# Altium project Capstone_Vent.PrjPcb
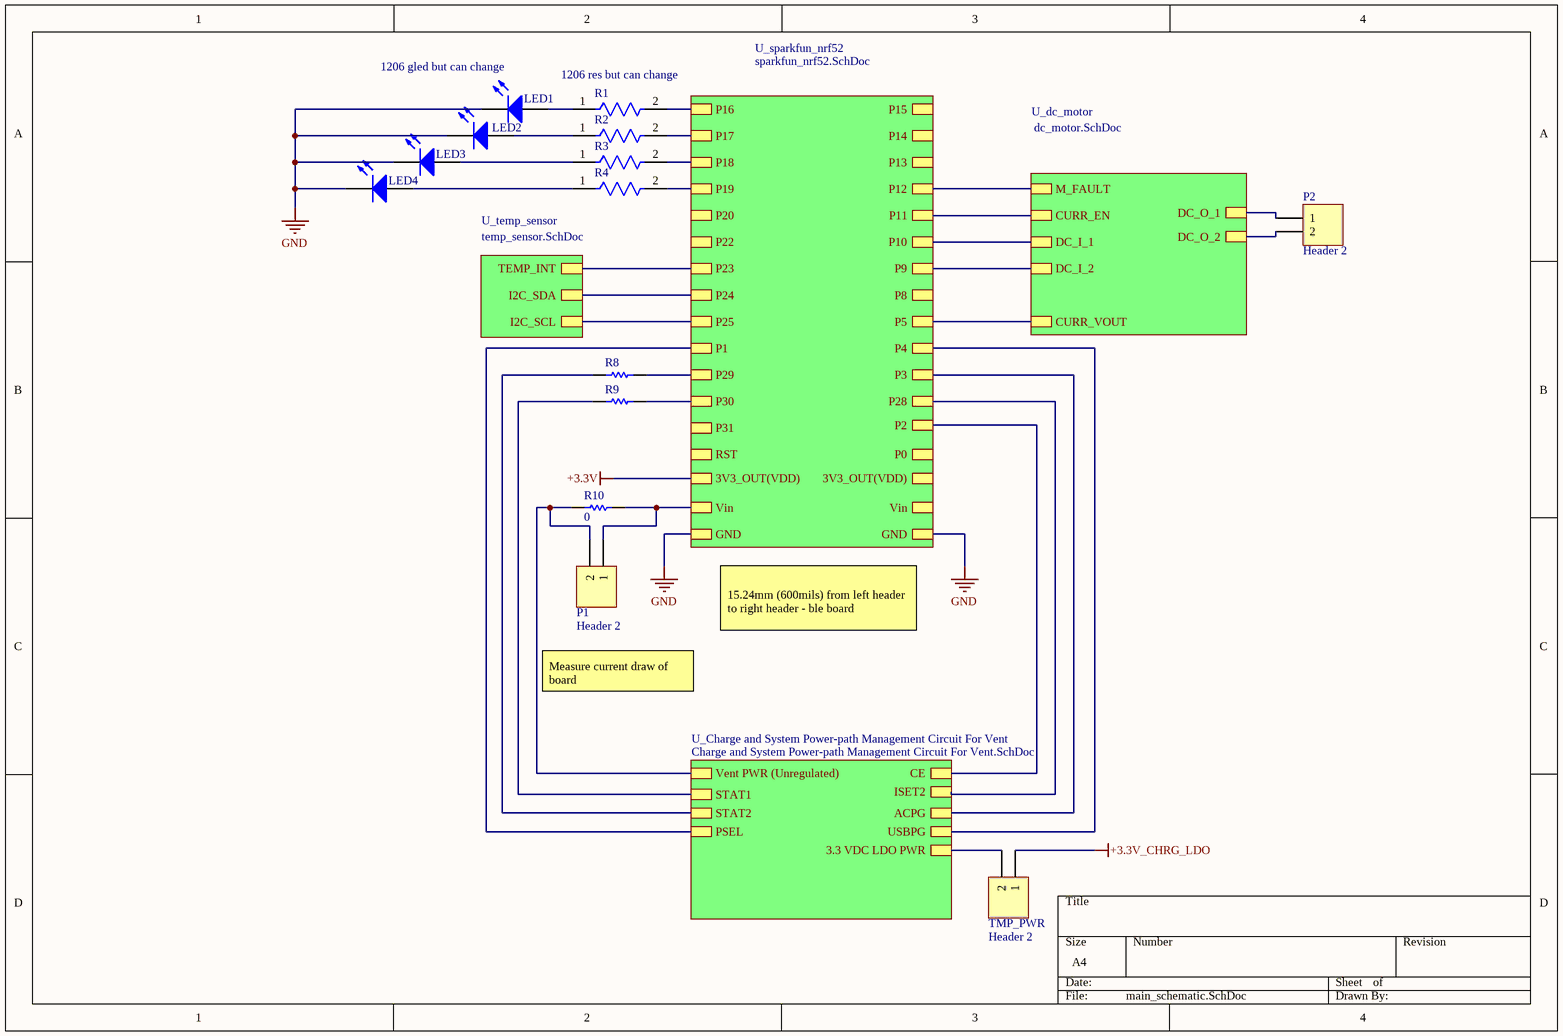
[diagram p0: main_schematic.SchDoc]
5 sheets, 56 parts. Net scope: hierarchical (ports join the sheet entries above them; power ports are global).
Board file: Vent_pcb.PcbDoc
Sheets:
  main_schematic.SchDoc
    U_sparkfun_nrf52 = sparkfun_nrf52.SchDoc
    U_temp_sensor = temp_sensor.SchDoc
    U_dc_motor = dc_motor.SchDoc
    U_Charge and System Power-path Management Circuit For Vent = Charge and System Power-path Management Circuit For Vent.SchDoc

## Sheet main_schematic.SchDoc
size A4

### Parts
LED1  (no value)  [1206_A]
LED2  (no value)  [1206_A]
LED3  (no value)  [1206_A]
LED4  (no value)  [1206_A]
P1  Header 2  [HDR1X2]
P2  Header 2  [HDR1X2]
R1  (no value)  [FP-RC1206-MFG]
R2  (no value)  [FP-RC1206-MFG]
R3  (no value)  [FP-RC1206-MFG]
R4  (no value)  [FP-RC1206-MFG]
R8  RC0805FR-0710KL  [RESC2013X60X35NL10T20]  (value not drawn)
R9  RC0805FR-0710KL  [RESC2013X60X35NL10T20]  (value not drawn)
R10  0  [RESC2013X70X40LL20T20]
TMP_PWR  Header 2  [HDR1X2]

### Sub-sheets
U_Charge and System Power-path Management Circuit For Vent = Charge and System Power-path Management Circuit For Vent.SchDoc: ISET2, STAT1, STAT2, USBPG, CE, PSEL, ACPG, Vent PWR (Unregulated), 3.3 VDC LDO PWR
U_dc_motor = dc_motor.SchDoc: DC_I_1, DC_I_2, M_FAULT, CURR_VOUT, CURR_EN, DC_O_2, DC_O_1
U_sparkfun_nrf52 = sparkfun_nrf52.SchDoc: P16, P17, P18, P19, P20, P22, P23, P24, P25, P28, P29, P30, P31, RST, Vin, GND, P15, P14, P13, P12, P11, P10, P9, P8, P5, P4, P3, P2, P1, P0, GND, 3V3_OUT(VDD), 3V3_OUT(VDD), Vin
U_temp_sensor = temp_sensor.SchDoc: I2C_SCL, TEMP_INT, I2C_SDA

### Nets
+3.3V: sheet U_sparkfun_nrf52/3V3_OUT(VDD), sheet U_sparkfun_nrf52/3V3_OUT(VDD)
+3.3V_CHRG_LDO: TMP_PWR.1
GND: LED1.1(K) LED2.1(K) LED3.1(K) LED4.1(K) ; sheet U_sparkfun_nrf52/GND, sheet U_sparkfun_nrf52/GND
NetC3_2: TMP_PWR.2 ; sheet U_Charge and System Power-path Management Circuit For Vent/3.3 VDC LDO PWR
NetC4_2: P1.2 R10.2 ; sheet U_Charge and System Power-path Management Circuit For Vent/Vent PWR (Unregulated)
NetIC1_1: P2.2 ; sheet U_dc_motor/DC_O_2
NetIC1_3: P2.1 ; sheet U_dc_motor/DC_O_1
NetIC1_6: sheet U_sparkfun_nrf52/P12, sheet U_dc_motor/M_FAULT
NetIC1_9: sheet U_sparkfun_nrf52/P10, sheet U_dc_motor/DC_I_1
NetIC1_10: sheet U_sparkfun_nrf52/P9, sheet U_dc_motor/DC_I_2
NetIC2_2: sheet U_sparkfun_nrf52/P11, sheet U_dc_motor/CURR_EN
NetIC2_5: sheet U_sparkfun_nrf52/P5, sheet U_dc_motor/CURR_VOUT
NetLED1_2: LED1.2(A) R1.1
NetLED2_2: LED2.2(A) R2.1
NetLED3_2: LED3.2(A) R3.1
NetLED4_2: LED4.2(A) R4.1
NetP1_1: P1.1 R10.1 ; sheet U_sparkfun_nrf52/Vin, sheet U_sparkfun_nrf52/Vin
NetPL_6: R9.2 ; sheet U_sparkfun_nrf52/P30
NetPL_7: R8.2 ; sheet U_sparkfun_nrf52/P29
NetPL_8: sheet U_sparkfun_nrf52/P28, sheet U_Charge and System Power-path Management Circuit For Vent/ISET2
NetPL_9: sheet U_sparkfun_nrf52/P25, sheet U_temp_sensor/I2C_SCL
NetPL_10: sheet U_sparkfun_nrf52/P24, sheet U_temp_sensor/I2C_SDA
NetPL_11: sheet U_sparkfun_nrf52/P23, sheet U_temp_sensor/TEMP_INT
NetPL_14: R4.2 ; sheet U_sparkfun_nrf52/P19
NetPL_15: R3.2 ; sheet U_sparkfun_nrf52/P18
NetPL_16: R2.2 ; sheet U_sparkfun_nrf52/P17
NetPL_17: R1.2 ; sheet U_sparkfun_nrf52/P16
NetPR_5: sheet U_sparkfun_nrf52/P1, sheet U_Charge and System Power-path Management Circuit For Vent/PSEL
NetPR_6: sheet U_sparkfun_nrf52/P2, sheet U_Charge and System Power-path Management Circuit For Vent/CE
NetPR_7: sheet U_sparkfun_nrf52/P3, sheet U_Charge and System Power-path Management Circuit For Vent/ACPG
NetPR_8: sheet U_sparkfun_nrf52/P4, sheet U_Charge and System Power-path Management Circuit For Vent/USBPG
NetR8_1: R8.1 ; sheet U_Charge and System Power-path Management Circuit For Vent/STAT2
NetR9_1: R9.1 ; sheet U_Charge and System Power-path Management Circuit For Vent/STAT1

### Notes on the sheet
- (near LED1) 1206 gled but can change
- (near R1) 1206 res but can change
- 15.24mm (600mils) from left header to right header - ble board
- Measure current draw of board

### Library data of the parts
LED1-LED4 = CMP-1426-00016-1: QTLP650C4TR / 1206 green led; PartNumber: 150120VS75000; Manufacturer: Wuerth Elektronik; Color: Bright Green; ComponentLink2URL: http://katalog.we-online.com/led/datasheet/150120VS75000.pdf; ComponentLink2Description: Datasheet; ComponentLink1URL: http://www.we-online.com; PackageReference: 1206_A; ComponentLink1Description: Manufacturer URL
P1 P2 TMP_PWR = Header 2: Header, 2-Pin; LatestRevisionDate: 17-Jul-2002; LatestRevisionNote: Re-released for DXP Platform.; Publisher: Altium Limited
R1-R4 = CMP-03412-007570-1: 360 ohms resistor / 1206 package; Manufacturer Part Number: RC1206JR-070RL; Manufacturer: YAGEO; Voltage Rating: 200V; Temperature Coefficient: 300ppm/°C; Power Rating: 0.25W; Value: 0Ω; Tolerance: 5%; Temperature Range Low: -55°C; Category: Res; Automotive: No; Ipc Land Pattern Name: RESC310160X55; Device Class L1: Passive Components; Temperature: -55°C to +155°C; ComponentLink2URL: https://www.yageo.com/upload/media/product/productsearch/datasheet/rchip/PYu-RC_Group_51_RoHS_L_10.pdf; Lead Free: Yes; Height: 0.65mm; Footprint Url: https://www.yageo.com/upload/website/yageo_PYu-R_Mount_10_19050818_343.pdf; Package: RC1206; Digikey Description: RES SMD 0 OHM JUMPER 1/4W 1206; Temperature Range High: +155°C; Device Class L3: Chip SMD Resistors; Device Class L2: Resistors; Octopart: https://octopart.com/rc1206jr-070rl-yageo-40025601; Resistance: 0Ω; Series: RC; ComponentLink2Description: Datasheet; Composition: Thick Film; RoHS: TRUE; Mouser Description: Resistor: thick film; SMD; 1206; 0O; 0.25W; ±5%; -55÷155°C
R8 R9 = CMP-1659-00013-4: Chip Resistor, 10 KOhm, +/- 1%, 0.125 W, -55 to 155 degC, 0805 (2012 Metric), RoHS, Tape and Reel; Manufacturer: Yageo; Voltage Rating: 150 V; Mount: Surface Mount; ComponentLink1Description: Manufacturer URL; ComponentLink2URL: http://www.yageo.com/documents/recent/PYu-RC_Group_51_RoHS_L_04.pdf; Pins: 2; Length: 2 mm; Min Operating Temperature: -55 degC; Height: 0.5 mm; Mounting Technology: Surface Mount; RoHSCompliant: true; REACH SVHC: No SVHC; ComponentLink1URL: http://www.yageo.com/; Max Operating Temperature: 155 degC; PackageReference: 0805; DatasheetVersion: Rev. 4, 02/2016; Package Quantity: 5000; Packaging: Tape and Reel; ComponentLink2Description: Datasheet; PackageDescription: 2-Pin Surface Mounted Device, Body 2 x 1.25 mm
R10 = CMP-2001-00419-1: 2012; Part Number: ERJ-6GEYJ471V; Manufacturer: Panasonic

## Sheet sparkfun_nrf52.SchDoc
size A4
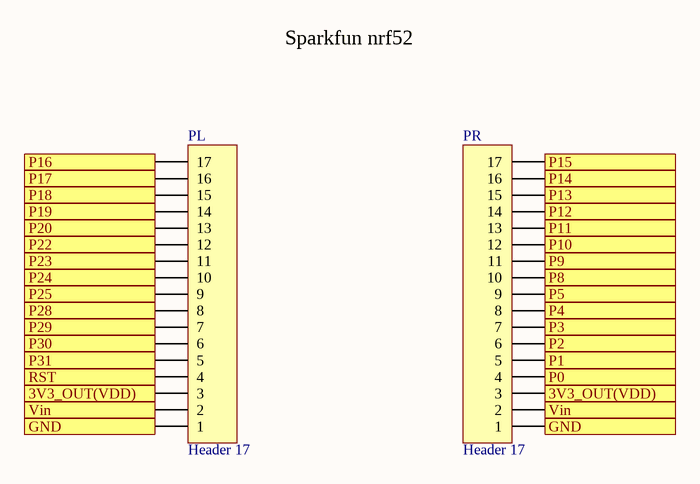
[diagram p1: sparkfun_nrf52.SchDoc]

### Parts
PL  Header 17  [HDR1X17]
PR  Header 17  [HDR1X17]

### Ports
3V3_OUT(VDD), GND, P0, P1, P2, P3, P4, P5, P8, P9, P10, P11, P12, P13, P14, P15, P16, P17, P18, P19, P20, P22, P23, P24, P25, P28, P29, P30, P31, RST, Vin

### Nets
+3.3V: PL.3 PR.3 ; port 3V3_OUT(VDD)
GND: PL.1 PR.1 ; port GND
NetIC1_6: PR.14 ; port P12
NetIC1_9: PR.12 ; port P10
NetIC1_10: PR.11 ; port P9
NetIC2_2: PR.13 ; port P11
NetIC2_5: PR.9 ; port P5
NetP1_1: PL.2 PR.2 ; port Vin
NetPL_4: PL.4 ; port RST
NetPL_5: PL.5 ; port P31
NetPL_6: PL.6 ; port P30
NetPL_7: PL.7 ; port P29
NetPL_8: PL.8 ; port P28
NetPL_9: PL.9 ; port P25
NetPL_10: PL.10 ; port P24
NetPL_11: PL.11 ; port P23
NetPL_12: PL.12 ; port P22
NetPL_13: PL.13 ; port P20
NetPL_14: PL.14 ; port P19
NetPL_15: PL.15 ; port P18
NetPL_16: PL.16 ; port P17
NetPL_17: PL.17 ; port P16
NetPR_4: PR.4 ; port P0
NetPR_5: PR.5 ; port P1
NetPR_6: PR.6 ; port P2
NetPR_7: PR.7 ; port P3
NetPR_8: PR.8 ; port P4
NetPR_10: PR.10 ; port P8
NetPR_15: PR.15 ; port P13
NetPR_16: PR.16 ; port P14
NetPR_17: PR.17 ; port P15

### Notes on the sheet
- Sparkfun nrf52

### Library data of the parts
PL PR = Header 17: Header, 17-Pin; LatestRevisionDate: 17-Jul-2002; LatestRevisionNote: Re-released for DXP Platform.; Publisher: Altium Limited

## Sheet temp_sensor.SchDoc
size A4
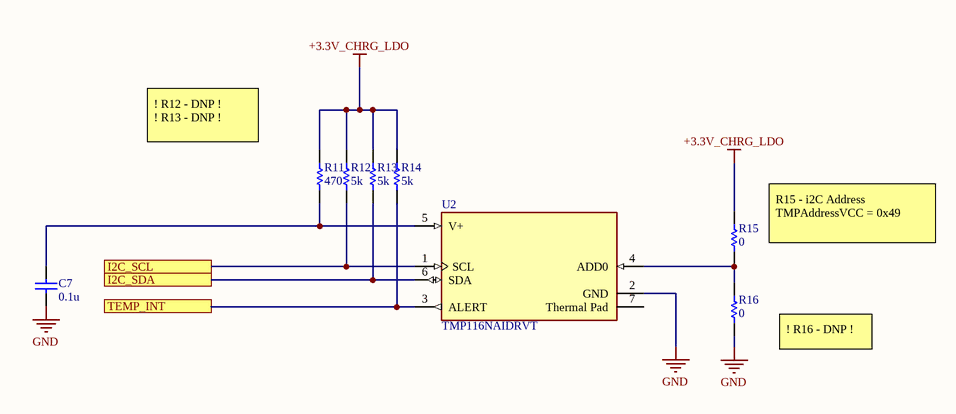
[diagram p2: temp_sensor.SchDoc]

### Parts
C7  0.1u  [CAPC2013X145X50LL20T25]
R11  470  [RESC2013X70X40LL20T20]
R12  5k  [RESC2013X70X40LL20T20]
R13  5k  [RESC2013X70X40LL20T20]
R14  5k  [RESC2013X70X40LL20T20]
R15  0  [RESC2013X70X40LL20T20]
R16  0  [RESC2013X70X40LL20T20]
U2  TMP116NAIDRVT  [FP-DRV0006A-MFG]

### Ports
I2C_SCL, I2C_SDA, TEMP_INT

### Nets
+3.3V_CHRG_LDO: R11.2 R12.2 R13.2 R14.2 R15.2
GND: C7.1 R16.1 U2.2(GND)
NetC7_2: C7.2 R11.1 U2.5(V+)
NetPL_9: R12.1 U2.1(SCL) ; port I2C_SCL
NetPL_10: R13.1 U2.6(SDA) ; port I2C_SDA
NetPL_11: R14.1 U2.3(ALERT) ; port TEMP_INT
NetR15_1: R15.1 R16.2 U2.4(ADD0)

Not connected (* = marked no-connect by the designer): U2 7(Thermal_Pad)

### Notes on the sheet
- ! R12 - DNP !
  ! R13 - DNP !
- (near R15) R15 - i2C Address TMPAddressVCC = 0x49
- (near R16) ! R16 - DNP !

### Library data of the parts
C7 = CMP-2007-01258-1: C0805C104Z5VACTU; Manufacturer: Kemet; Part Number: C0805C104Z5VACTU
R11 = CMP-2001-00419-1: ERJ-6GEYJ471V; Manufacturer: Panasonic; Part Number: ERJ-6GEYJ471V
R12-R16 = CMP-2001-00419-1: as R10 on sheet main_schematic
U2 = CMP-04948-000020-1: SENSOR DIGITAL -55C-125C 6WSON; Manufacturer: Texas Instruments; Max Supply Voltage: 5.5V; Min Supply Voltage: 1.9V; Standoff Height: 0mm; Accuracy: 0.2%; Operating Supply Current: 3.5-135uA; Max Junction Temp: +150°C; Interface: I2C,SMBus; Resolution: 16bits; Temperature Range High: +125°C; Device Class L1: Sensors; Package: DRV0006A; Temperature Range Low: -55°C; Lead Free: Yes; Digikey Description: SENSOR DIGITAL -55C-125C 6WSON; RoHS: TRUE; Height: 0.8mm; Ambient Temperature Range High: +150°C; Temperature: -55°C to +125°C; ComponentLink2Description: Datasheet; Device Class L3: unset; Ambient Temperature Range Low: -55°C; Category: IC; Octopart: https://octopart.com/tmp116naidrvt-texas+instruments-82367759; Device Class L2: Temperature and Humidity Sensors; Manufacturer Part Number: TMP116NAIDRVT; ComponentLink2URL: http://www.ti.com/lit/ds/symlink/tmp116.pdf; Automotive: No

## Sheet dc_motor.SchDoc
size A4
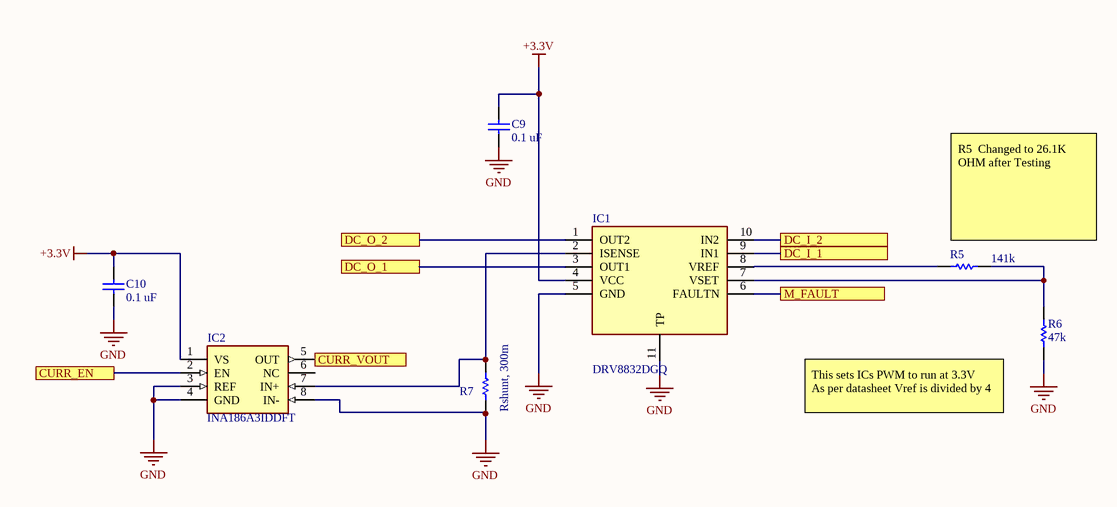
[diagram p3: dc_motor.SchDoc]

### Parts
C9  0.1 uF  [CAPC2013X145X50LL20T25]
C10  0.1 uF  [CAPC2013X145X50LL20T25]
IC1  DRV8832DGQ  [SOP50P490X110-11N]
IC2  INA186A3IDDFT  [SOT65P280X110-8N]
R5  141k  [RESC2013X60X35NL10T20]
R6  47k  [RESC2013X60X35NL10T20]
R7  Rshunt, 300m  [RESC3116X65X40ML10T20]

### Ports
CURR_EN, CURR_VOUT, DC_I_1, DC_I_2, DC_O_1, DC_O_2, M_FAULT

### Nets
+3.3V: C9.2 C10.2 IC1.4(VCC) IC2.1(VS)
GND: C9.1 C10.1 IC1.5(GND) IC1.11(TP) IC2.3(REF) IC2.4(GND) IC2.8(IN-) R6.1 R7.1
NetIC1_1: IC1.1(OUT2) ; port DC_O_2
NetIC1_2: IC1.2(ISENSE) IC2.7(IN+) R7.2
NetIC1_3: IC1.3(OUT1) ; port DC_O_1
NetIC1_6: IC1.6(FAULTN) ; port M_FAULT
NetIC1_7: IC1.7(VSET) R5.1 R6.2
NetIC1_8: IC1.8(VREF) R5.2
NetIC1_9: IC1.9(IN1) ; port DC_I_1
NetIC1_10: IC1.10(IN2) ; port DC_I_2
NetIC2_2: IC2.2(EN) ; port CURR_EN
NetIC2_5: IC2.5(OUT) ; port CURR_VOUT

Not connected (* = marked no-connect by the designer): IC2 6(NC)

### Notes on the sheet
- (near R5) R5  Changed to 26.1K OHM after Testing
- (near R6) This sets ICs PWM to run at 3.3V
  As per datasheet Vref is divided by 4

### Library data of the parts
C9 C10 = CMP-2007-01258-1: Manufacturer: Kemet; Part Number: C0805C104Z5VACTU
IC1 = DRV8832DGQ: Integrated Circuit; Manufacturer_Name: Texas Instruments; Datasheet Link: http://datasheet.octopart.com/DRV8832DGQ-Texas-Instruments-datasheet-10258026.pdf; Height: 1.1mm; Manufacturer_Part_Number: DRV8832DGQ; Arrow Part Number: DRV8832DGQ; Arrow Price/Stock: https://www.arrow.com/en/products/drv8832dgq/texas-instruments; Mouser Part Number: 595-DRV8832DGQ; Mouser Price/Stock: https://www.mouser.co.uk/ProductDetail/Texas-Instruments/DRV8832DGQ?qs=O1HRStiETChGrPfF5MJfDw%3D%3D
IC2 = INA186A3IDDFT: Integrated Circuit; Manufacturer_Name: Texas Instruments; Datasheet Link: https://www.ti.com/lit/ds/symlink/ina186.pdf?ts=1591829586496&ref_url=https://www.ti.com/product/INA186; Height: 1.45mm; Manufacturer_Part_Number: INA186A3IDDFT; Arrow Part Number: INA186A3IDDFT
R5 = CMP-1659-00011-4: ERJ-6ENF1403V 141K; Manufacturer: Yageo; Voltage Rating: 150 V; Height: 0.5 mm; ComponentLink2URL: http://www.yageo.com/documents/recent/PYu-RC_Group_51_RoHS_L_04.pdf; ComponentLink2Description: Datasheet; Package Quantity: 200; Max Operating Temperature: 155 degC; Min Operating Temperature: -55 degC; Packaging: Tape and Reel; Pins: 2; PackageReference: 0805; Mounting Technology: Surface Mount; ComponentLink1Description: Manufacturer URL; ComponentLink1URL: http://www.yageo.com/; PackageDescription: 2-Pin Surface Mounted Device, Body 2 x 1.25 mm; Length: 2 mm; REACH SVHC: No SVHC; Mount: Surface Mount; RoHSCompliant: true; DatasheetVersion: Rev. 4, 02/2016
R6 = CMP-1659-00011-4: Chip Resistor, 47 KOhm, +/- 1%, 0.125 W, -55 to 155 degC, 0805 (2012 Metric), RoHS, Tape and Reel, RC0805FR-0747KL; Manufacturer: Yageo; Voltage Rating: 150 V; Height: 0.5 mm; ComponentLink2URL: http://www.yageo.com/documents/recent/PYu-RC_Group_51_RoHS_L_04.pdf; ComponentLink2Description: Datasheet; Package Quantity: 200; Max Operating Temperature: 155 degC; Min Operating Temperature: -55 degC; Packaging: Tape and Reel; Pins: 2; PackageReference: 0805; Mounting Technology: Surface Mount; ComponentLink1Description: Manufacturer URL; ComponentLink1URL: http://www.yageo.com/; PackageDescription: 2-Pin Surface Mounted Device, Body 2 x 1.25 mm; Length: 2 mm; REACH SVHC: No SVHC; Mount: Surface Mount; RoHSCompliant: true; DatasheetVersion: Rev. 4, 02/2016
R7 = CMP-2100-03678-1: CSR1206FKR300 / RES 0.3 OHM 1% 1/2W 1206; Manufacturer: Yageo; Temperature Coefficient: 100ppm/degreesC; Power Rating: 250mW; Voltage Rating: 200V; Resistance: 1KOhm; Composition: ThickFilm; Min Operating Temperature: -55degC; Tolerance: 1%; REACH SVHC: Unknown; Case Code (Metric): 3216; Military Standard: Not; Datasheet Version: Rev. 5, 10/2016; Package Reference: 1206.0; Case/Package: 1206; Length: 3.1mm; Manufacturer URL: http://www.yageo.com/; Lead Free: LeadFree; RoHSCompliant: true; Termination: SMD/SMT; Packaging: TapeandReel; Package Description: 2-Pin Surface Mount Device, Body 3.1 x 1.6 mm; Depth: 1.6mm; Case Code (Imperial): 1206; Max Operating Temperature: 155degC; Datasheet URL: http://www.yageo.com/NewPortal/yageodocoutput?fileName=/pdf/R-Chip/PYu-RC_Group_51_RoHS_L_5.pdf; Height: 0.55mm

## Sheet Charge and System Power-path Management Circuit For Vent.SchDoc
size A
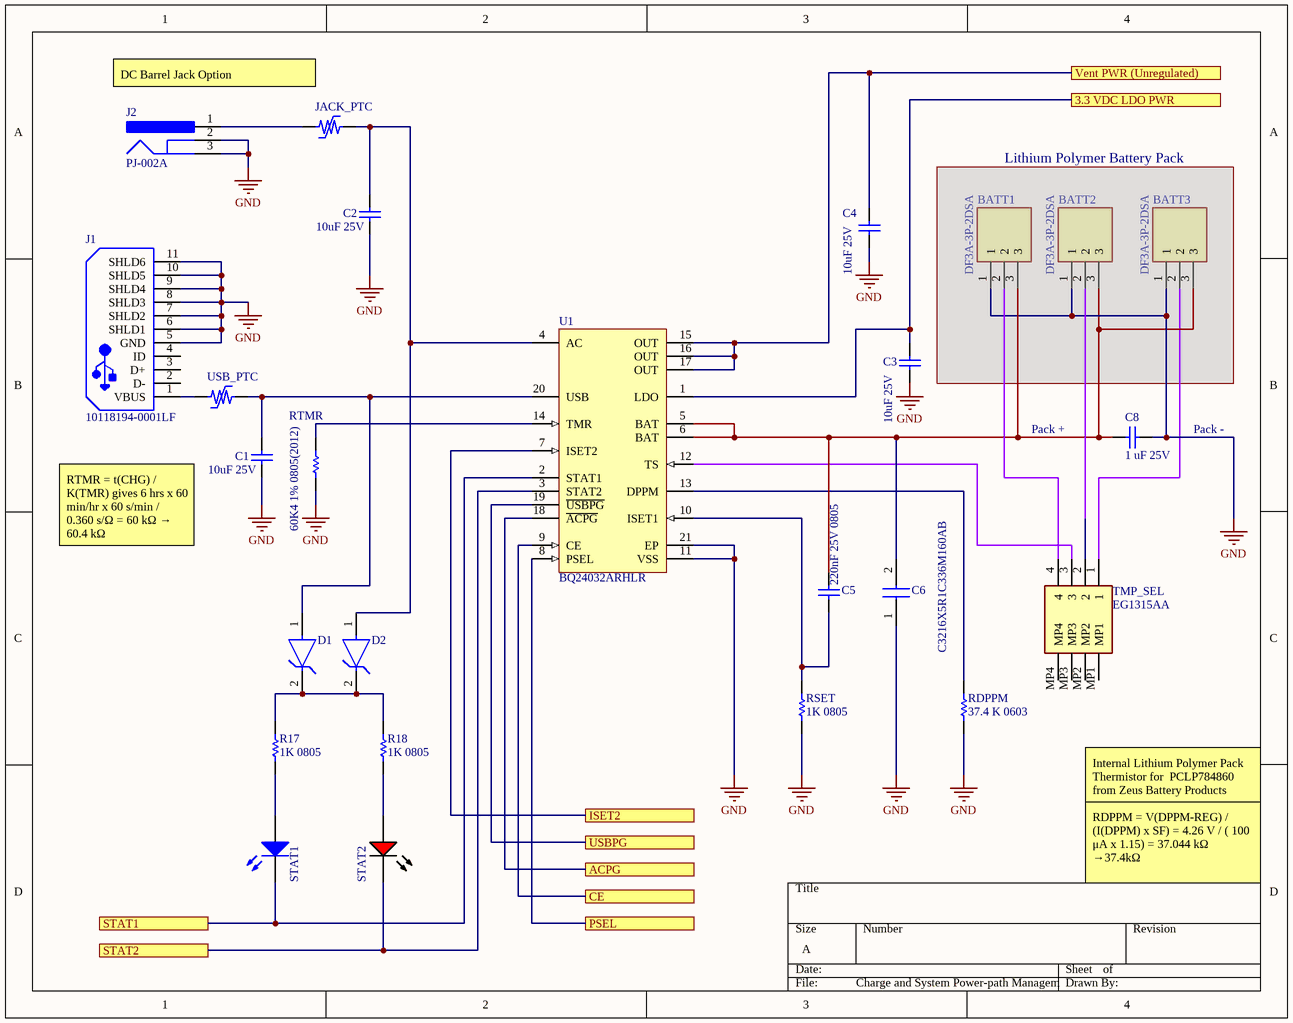
[diagram p4: Charge and System Power-path Management Circuit For Vent.SchDoc]

### Parts
BATT1  DF3A-3P-2DSA  [SHDR3W50P0X200_1X3_800X500X500P]
BATT2  DF3A-3P-2DSA  [SHDR3W50P0X200_1X3_800X500X500P]
BATT3  DF3A-3P-2DSA  [SHDR3W50P0X200_1X3_800X500X500P]
C1  10uF 25V  [CAPC2013X135X45ML10T25]
C2  10uF 25V  [CAPC2013X135X45ML10T25]
C3  10uF 25V  [CAPC2013X135X45ML10T25]
C4  10uF 25V  [CAPC2013X135X45ML10T25]
C5  220nF 25V 0805  [CAPC0805(2012)100_M]
C6  C3216X5R1C336M160AB  [C1206]
C8  1 uF 25V  [CAPC1608X90X35LL10T25]
D1  MM3Z3V3B  [FP-MM3Z3V3B-MFG]  (value not drawn)
D2  MM3Z3V3B  [FP-MM3Z3V3B-MFG]  (value not drawn)
J1  10118194-0001LF  [FCI-10118194-0001LF-5_V]
J2  PJ-002A  [CUI-PJ-002A_V]
JACK_PTC  MF-MSMF110/24X-2  [BOUR-MF-MSMF110-24X-2_V]  (value not drawn)
R17  1K 0805  [RESC2013X60X35ML10T20]
R18  1K 0805  [RESC2013X60X35ML10T20]
RDPPM  37.4 K 0603  [RESC1608X55X25ML10T15]
RSET  1K 0805  [RESC2013X60X35ML10T20]
RTMR  60K4 1% 0805(2012)  [RESC0805(2012)_M]
STAT1  (no value)  [1206_A]
STAT2  LTST-C150KRKT  [LTST-C150KRKT_V]  (value not drawn)
TMP_SEL  EG1315AA  [EG1315AA]
U1  BQ24032ARHLR  [RHL0020A_V]
USB_PTC  MF-MSMF110/24X-2  [BOUR-MF-MSMF110-24X-2_V]  (value not drawn)

### Blocks framed on the sheet
Lithium Polymer Battery Pack: BATT1-BATT3

### Ports
3.3 VDC LDO PWR, ACPG, CE, ISET2, PSEL, STAT1, STAT2, USBPG, Vent PWR (Unregulated)

### Nets
GND: BATT1.1 BATT2.1 BATT3.1 C1.1 C2.1 C3.1 C4.1 C6.1 C8.1 J1.5(GND) J1.6(SHLD1) J1.7(SHLD2) J1.8(SHLD3) J1.9(SHLD4) J1.10(SHLD5) J1.11(SHLD6) J2.2 J2.3 RDPPM.1 RSET.1 RTMR.1 U1.11(VSS) U1.21(EP)
NetBATT1_2: BATT1.2 TMP_SEL.4
NetBATT1_3: BATT1.3 BATT2.3 BATT3.3 C5.2 C6.2 C8.2 U1.5(BAT) U1.6(BAT)
NetBATT2_2: BATT2.2 TMP_SEL.2
NetBATT3_2: BATT3.2 TMP_SEL.1
NetC1_2: C1.2 D1.1(A) U1.20(USB) USB_PTC.2
NetC2_2: C2.2 D2.1(A) JACK_PTC.2 U1.4(AC)
NetC3_2: C3.2 U1.1(LDO) ; port 3.3 VDC LDO PWR
NetC4_2: C4.2 U1.15(OUT) U1.16(OUT) U1.17(OUT) ; port Vent PWR (Unregulated)
NetC5_1: C5.1 RSET.2 U1.10(ISET1)
NetD1_2: D1.2(C) D2.2(C) R17.2 R18.2
NetJ1_1: J1.1(VBUS) USB_PTC.1
NetJ2_1: J2.1 JACK_PTC.1
NetPL_8: U1.7(ISET2) ; port ISET2
NetPR_5: U1.8(PSEL) ; port PSEL
NetPR_6: U1.9(CE) ; port CE
NetPR_7: U1.18(~{ACPG}) ; port ACPG
NetPR_8: U1.19(~{USBPG}) ; port USBPG
NetR8_1: STAT2.2(K) U1.3(STAT2) ; port STAT2
NetR9_1: STAT1.1(K) U1.2(STAT1) ; port STAT1
NetR17_1: R17.1 STAT1.2(A)
NetR18_1: R18.1 STAT2.1(A)
NetRDPPM_2: RDPPM.2 U1.13(DPPM)
NetRTMR_2: RTMR.2 U1.14(TMR)
NetTMP_SEL_3: TMP_SEL.3 U1.12(TS)

Not connected (* = marked no-connect by the designer): J1 2(D-) 3(D+) 4(ID); TMP_SEL MP1 MP2 MP3 MP4

### Notes on the sheet
- DC Barrel Jack Option
- Pack +
- Pack -
- RTMR = t(CHG) / K(TMR) gives 6 hrs x 60 min/hr x 60 s/min / 0.360 s/Ω = 60 kΩ →
  60.4 kΩ
- Internal Lithium Polymer Pack Thermistor for  PCLP784860 from Zeus Battery Products
- RDPPM = V(DPPM-REG) / (I(DPPM) x SF) = 4.26 V / ( 100 μA x 1.15) = 37.044 kΩ →37.4kΩ

### Library data of the parts
BATT1-BATT3 = DF3A-3P-2DSA: Connector; Manufacturer_Name: Hirose; Datasheet Link: https://componentsearchengine.com/Datasheets/2/DF3A-3P-2DSA.pdf; Height: 5mm; Manufacturer_Part_Number: DF3A-3P-2DSA; Arrow Part Number: DF3A-3P-2DSA; Mouser Part Number: 798-DF3A-3P-2DSA; Mouser Price/Stock: https://www.mouser.co.uk/ProductDetail/Hirose-Connector/DF3A-3P-2DSA?qs=Ux3WWAnHpjDjdLpYq8Mr3A%3D%3D
C1-C4 = CMP-2007-03541-1: Part Number: GRM21BR61E106KA73L; Manufacturer: Murata
C5 = CMP-1036-04543-1: CAP 220nF 25V ±10% 0805 (2012 Metric) Thickness 1mm SMD; Case-EIA: 0805; Tolerance: Â±10%; Case-Metric: 2012; Max Thickness: 1 mm; Value: 220nF; Technology: SMT; Rated Voltage: 25 V
C6 = C3216X5R1C336M160AB: Capacitor; Manufacturer_Name: TDK; Datasheet Link: https://product.tdk.com/info/en/catalog/datasheets/mlcc_commercial_midvoltage_en.pdf; Height: 1.8mm; Manufacturer_Part_Number: C3216X5R1C336M160AB; Arrow Part Number: C3216X5R1C336M160AB; Arrow Price/Stock: https://www.arrow.com/en/products/c3216x5r1c336m160ab/tdk; Mouser Part Number: 810-C3216X5R1C336M; Mouser Price/Stock: https://www.mouser.com/Search/Refine.aspx?Keyword=810-C3216X5R1C336M
C8 = CMP-2000-07260-1: Chip Capacitor, 1 uF, +/- 10%, 25 V, -55 to 85 degC, 0603 (1608 Metric), RoHS, Tape and Reel; PCN Part Number: X5R,X7RDielectrics23/Jan/2008; Manufacturer: Taiyo Yuden; Kits: 587-1797-KIT-ND-KITCAPCERHICAP0603&0805S; Other Names: 587-1248-1; Temperature Coefficient: X5R; Capacitance: 1µF; Catalog Drawings: xMKSeries_0603_0.8; Online Catalog: MSeries; Features: -; Datasheet Version: 09/2016; Mounting Type: SurfaceMount,MLCC; Voltage - Rated: 25V; Category: Capacitors; Tolerance: ±10%; Applications: GeneralPurpose; Ratings: -; Lead Spacing: -; Packaging: CutTape(CT); Family: CeramicCapacitors; Datasheet URL: http://ds.yuden.co.jp/TYCOMPAS/ut/detail.do?productNo=TMK107BJ105KA-T&fileName=TMK107BJ105KA-T_SS&mode=specSheetDownload; Thickness (Max): 0.035"(0.90mm); Operating Temperature: -55°C~85°C; Series: M; Manufacturer URL: http://www.t-yuden.com/; Size / Dimension: 0.063"Lx0.031"W(1.60mmx0.80mm); Package Reference: 0603; Lead Style: -; Package / Case: 0603(1608Metric); Mounting Technology: SurfaceMount; Height - Seated (Max): -; Standard Package: 1; Package Description: 2-Pin Surface Mount Device, Body 1.6 x 0.8 mm
D1 D2 = CMP-07164-000001-1: DIODE ZENER 3.3V 200MW SOD323F; Manufacturer: ON Semiconductor; Reverse Voltage: 1V; Max Reverse Leakage Current: 4.5uA; Max Zener Voltage: 3.37V; Zener Impedance: 89Ω; Forward Current: 10mA; Max Junction Temp: +150°C; ComponentLink2URL: https://www.onsemi.com/pub/Collateral/MM3Z9V1B-D.pdf; Automotive: No; Power Dissipation: 200mW; ComponentLink2Description: Datasheet; Octopart: https://octopart.com/mm3z3v3b-on+semiconductor-84329878; Category: Diode; Package: MM3Z3V3B; Height: 1mm; Device Class L1: Discrete Semiconductors; Mouser Description: Zener Diodes Diode Zener 3.3V 200mW 2%; Manufacturer Part Number: MM3Z3V3B; Device Class L2: Diodes; Temperature Range High: +150°C; Lead Free: Yes; Temperature: to +150°C; RoHS: TRUE; Digikey Description: DIODE ZENER 3.3V 200MW SOD323F; Nom Zener Voltage: 3.3V; Device Class L3: Zener Diodes
J1 = CMP-2000-05120-1: Micro USB B Type Receptacle, 1.8 A, -55 to 85 degC, 5-Pin SMD, RoHS, Tape and Reel; Manufacturer: Amphenol FCI; Body Orientation: RightAngle; Number of Contacts: 5; Pitch: 0.65mm; Gender: RCP; Rad Hard: No; Package Reference: 10118194-0001LF-5; Mounting: SurfaceMount; Manufacturer URL: http://www.fci.com/; Packaging: CutTape; Datasheet URL: https://datasheet.ciiva.com/26945/getdatasheetpartid-418619-26945695.pdf; Termination Method: Solder; Package Description: 5-Pin Surface Mount Device, Body 8.05 x 5.53 mm, Pitch 0.65 mm; Type: MicroUSBTypeB; Datasheet Version: Rev. A, 10/2011
J2 = CMP-2000-06895-1: Through Hole Right Angle DC Power Jack, 2.5 A, 2 mm Center Pin, 3 Position, -25 to 85 degC, RoHS, Bulk; Manufacturer: CUIInc.; Current Rating: 2.5A; Inside Contact Diameter: 2mm; Insulation Resistance: 50MOhms; Outside Contact Diameter: 6.5mm; Voltage Rating: 24V; Brand: CUI; Operating Temperature Range: -25Cto+85C; Mounting Technology: ThroughHole; Connector Type: DCPowerJack; Contact Material: Copper; Datasheet URL: http://www.cui.com/product/resource/pj-002a.pdf; Contact Gender: Male; Housing Material: PolybutyleneTerephthalate(PBT); Manufacturer URL: http://www.cui.com/; Package Reference: PJ-002A; Mounting Style: ThroughHole; Mounting Angle: Right; Product Category: DCPowerConnectors; Product: Jacks; Flammability Rating: UL94V-0; Contact Plating: Nickel; RoHS: True; Datasheet Version: Rev. 1.03, 04/2016; Package Description: 3-Pin Through Hole Device, Body 14.4 x 9 mm, Height 11 mm; Factory Pack Quantity: 500; Termination Style: ThroughHole
JACK_PTC USB_PTC = CMP-2100-03655-1: PTC Resettable Fuse, 24 V, 1.1 A, -40 to 85 degC, 2-Pin SMD, RoHS, Tape and Reel; Manufacturer: Bourns; Max Current Rating: 20A; Power Dissipation: 800mW; Supply Voltage: 24V; Number of Terminals: 2; Max Operating Temperature: 85degC; Case Code (Metric): 4532; Width: 3.41mm; RoHSCompliant: true; Contact Plating: Gold; Package Reference: MF-MSMF110-24X-2; Min Operating Temperature: -40degC; Packaging: TapeandReel; Mount: SurfaceMount; Case Code (Imperial): 1812; Length: 4.83mm; Height: 1.6mm; Case/Package: 1812; Datasheet URL: http://www.bourns.com/docs/Product-Datasheets/mfmsmf.pdf; Datasheet Version: Rev. AG, 08/2016; Voltage Rating: 24V; REACH SVHC: NoSVHC; Voltage Rating (DC): 24V; Radiation Hardening: No; Package Description: 2-Pin Surface Mount Device, Body 4.6 x 3.24 mm; Manufacturer URL: http://www.bourns.com/
R17 R18 RSET = CMP-2100-03671-1: Chip Resistor, 1 KOhm, +/- 1%, 125 mW, -55 to 155 degC, 0805 (2012 Metric), RoHS, Tape and Reel; Manufacturer: Yageo; Temperature Coefficient: 100ppm/degreesC; Voltage Rating (DC): 150V; Max Power Dissipation: 125mW; Resistance: 1KOhm; Number of Pins: 2; Number of Terminations: 2; Datasheet URL: http://www.yageo.com/NewPortal/yageodocoutput?fileName=/pdf/R-Chip/PYu-RC_Group_51_RoHS_L_5.pdf; Length: 0.079inch; Package Description: 2-Pin Surface Mounted Device, Body 2 x 1.25 mm; Depth: 1.25mm; Height: 0.024inch; Military Standard: Not; Case/Package: 0805; Package Reference: 0805; RoHSCompliant: true; Lead Free: LeadFree; Packaging: TapeandReel; Package Quantity: 1; Datasheet Version: Rev. 5, 10/2016; Tolerance: 1%; Min Operating Temperature: -55degC; Voltage Rating: 150V; Composition: ThickFilm; Case Code (Imperial): 0805; Power Rating: 125mW; Width: 0.049inch; Case Code (Metric): 2012; Manufacturer URL: http://www.yageo.com/; Max Operating Temperature: 155degC; REACH SVHC: Unknown; Termination: SMD/SMT
RDPPM = CMP-2000-04029-1: Manufacturer: Yageo; Part Number: RC0603FR-0737K4L
RTMR = CMP-1013-00711-1: 60K4 0.125W 1% 0805 (2012 Metric)  SMD; Value: 60400.00 Ohm; Case-EIA: 0805; Case-Metric: 2012; Power: 0.125 W; Technology: SMT; Tolerance: 1 %
STAT1 = CMP-1426-00016-1: LTST-C150GKT / 1206 green led; ComponentLink2URL: http://katalog.we-online.com/led/datasheet/150120VS75000.pdf; PartNumber: LTST-C150GKT; Color: Bright Green; ComponentLink2Description: Datasheet; ComponentLink1URL: http://www.we-online.com; PackageReference: 1206_A; ComponentLink1Description: Manufacturer URL
STAT2 = CMP-2000-06617-1: LED Red, 62.5 mW, 50 mA, -30 to 85 degC, 2-Pin SMD, RoHS, Tape and Reel; Manufacturer: Lite-On; Chip Material: AlGaInP; Product Depth (mm): 1.6mm; Luminous Intensity: 54mcd; Number of  Elements: 1; Reverse Voltage: 5V; Viewing Angle: 130deg; Rad Hardened: No; Shape Type: Rectangular; Peak Wavelength: 639nm; Forward Current: 30mA; Main Category: ChipLED; Product Height (mm): 1.1mm; Forward Voltage: 2.4V; Product Length (mm): 3.2mm; High Brightness: Yes; DELETED: Compliant; Test Current (It): 20mA; Power Dissipation: 75W; Dominant Wave Length: 631nm; Mounting: SurfaceMount; Package Type: ChipLed; Manufacturer URL: http://www.us.liteon.com/; Datasheet Version: Rev. C, 01/2013; Lens Dimensions: 2.06X1.6X0.6mm; Package Reference: C150KRKT; Operating Temp Range: -55Cto85C; Packaging: TapeandReel; Package Description: 2-Pin Surface Mount Device, Body 3.2 x 1.6 mm; Lum Intensity: 54mcd; Datasheet URL: http://optoelectronics.liteon.com/upload/download/DS-22-99-0149/S_110_LTST-C150KRKT.pdf; Emitting Color: Red; Operating Temperature Classification: Industrial; Mounting Technology: SurfaceMount; Type: Uni-Color; Pin Count: 2
TMP_SEL = EG1315AA: Switch; Manufacturer_Name: E-Switch; Datasheet Link: https://www.mouser.co.uk/datasheet/2/140/N131500-1501042.pdf; Height: 1.4mm; Manufacturer_Part_Number: EG1315AA; Arrow Part Number: EG1315AA; Mouser Part Number: 612-EG1315AA; Mouser Price/Stock: https://www.mouser.co.uk/ProductDetail/E-Switch/EG1315AA?qs=w%2Fv1CP2dgqqTYZUZmbcI7Q%3D%3D
U1 = CMP-0321-00146-2: Dual Input Li-Ion Charger with Dynamic Power Path, Output regulated to 4.4 V, Vbat 4.2 V, 4.3 V, -40 to 85 degC, 20-pin QFN (RHL), Green (RoHS & no Sb/Br); Manufacturer: Texas Instruments; Vin(Min)(V): 4.3; Li-Ion: Y; SubFamily: Battery Charge Management; NiCd: N; Mounting Technology: Surface Mount; DatasheetVersion: SLUS618H; PackageReference: RHL0020A; PartNumber: BQ24032ARHLR; Li-Polymer: Y; ComponentLink1Description: Datasheet; Over Voltage Protection: N; Eco-Plan: Green (RoHS & no Sb/Br); PackageVersion: revJ, Dec-2011; ComponentLink1URL: http://www.ti.com/general/docs/lit/getliterature.tsp?genericPartNumber=BQ24032A&fileType=pdf; Lead Acid: N; PackageDescription: 20-Leads Plastic Quad Flatpack No-Lead, 4.5 x 3.5 x 0.9 mm Body, 0.5 mm Pitch, Exposed Pad; NiMH: N

## Nets that join several sheets
+3.3V: sparkfun_nrf52 (PL.3 PR.3), dc_motor (C9.2 C10.2 IC1.4 IC2.1)
+3.3V_CHRG_LDO: main_schematic (TMP_PWR.1), temp_sensor (5 pins)
GND: main_schematic (LED1.1 LED2.1 LED3.1 LED4.1), sparkfun_nrf52 (PL.1 PR.1), temp_sensor (C7.1 R16.1 U2.2), dc_motor (9 pins), Charge and System Power-path Management Circuit For Vent (23 pins)
NetC3_2: main_schematic (TMP_PWR.2), Charge and System Power-path Management Circuit For Vent (C3.2 U1.1)
NetC4_2: main_schematic (P1.2 R10.2), Charge and System Power-path Management Circuit For Vent (C4.2 U1.15 U1.16 U1.17)
NetIC1_1: main_schematic (P2.2), dc_motor (IC1.1)
NetIC1_3: main_schematic (P2.1), dc_motor (IC1.3)
NetIC1_6: sparkfun_nrf52 (PR.14), dc_motor (IC1.6)
NetIC1_9: sparkfun_nrf52 (PR.12), dc_motor (IC1.9)
NetIC1_10: sparkfun_nrf52 (PR.11), dc_motor (IC1.10)
NetIC2_2: sparkfun_nrf52 (PR.13), dc_motor (IC2.2)
NetIC2_5: sparkfun_nrf52 (PR.9), dc_motor (IC2.5)
NetP1_1: main_schematic (P1.1 R10.1), sparkfun_nrf52 (PL.2 PR.2)
NetPL_6: main_schematic (R9.2), sparkfun_nrf52 (PL.6)
NetPL_7: main_schematic (R8.2), sparkfun_nrf52 (PL.7)
NetPL_8: sparkfun_nrf52 (PL.8), Charge and System Power-path Management Circuit For Vent (U1.7)
NetPL_9: sparkfun_nrf52 (PL.9), temp_sensor (R12.1 U2.1)
NetPL_10: sparkfun_nrf52 (PL.10), temp_sensor (R13.1 U2.6)
NetPL_11: sparkfun_nrf52 (PL.11), temp_sensor (R14.1 U2.3)
NetPL_14: main_schematic (R4.2), sparkfun_nrf52 (PL.14)
NetPL_15: main_schematic (R3.2), sparkfun_nrf52 (PL.15)
NetPL_16: main_schematic (R2.2), sparkfun_nrf52 (PL.16)
NetPL_17: main_schematic (R1.2), sparkfun_nrf52 (PL.17)
NetPR_5: sparkfun_nrf52 (PR.5), Charge and System Power-path Management Circuit For Vent (U1.8)
NetPR_6: sparkfun_nrf52 (PR.6), Charge and System Power-path Management Circuit For Vent (U1.9)
NetPR_7: sparkfun_nrf52 (PR.7), Charge and System Power-path Management Circuit For Vent (U1.18)
NetPR_8: sparkfun_nrf52 (PR.8), Charge and System Power-path Management Circuit For Vent (U1.19)
NetR8_1: main_schematic (R8.1), Charge and System Power-path Management Circuit For Vent (STAT2.2 U1.3)
NetR9_1: main_schematic (R9.1), Charge and System Power-path Management Circuit For Vent (STAT1.1 U1.2)